# Altium schematic sheet Connectors.SchDoc
size 209 x 148 mm
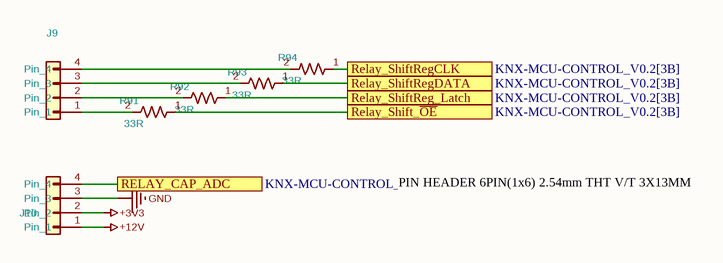
[diagram p0: Connectors.SchDoc]

## Parts
J9  DK501-1X6SBT-3X13MM  [PinHeader_1x04_P2.54mm_Vertical]  (value not drawn)
J10  DK501-1X6SBT-3X13MM  [PinHeader_1x04_P2.54mm_Vertical]  (value not drawn)
R91  33R  [R_0603_1608Metric]
R92  33R  [R_0603_1608Metric]
R93  33R  [R_0603_1608Metric]
R94  33R  [R_0603_1608Metric]

## Ports
RELAY_CAP_ADC (see KNX-MCU-CONTROL_V0.2[4C]), Relay_Shift_~{OE} (see KNX-MCU-CONTROL_V0.2[3B]), Relay_ShiftReg_Latch (see KNX-MCU-CONTROL_V0.2[3B]), Relay_ShiftRegCLK (see KNX-MCU-CONTROL_V0.2[3B]), Relay_ShiftRegDATA (see KNX-MCU-CONTROL_V0.2[3B])

## Nets
+3V3: J10.2(Pin_2)
+12V: J10.1(Pin_1)
GND: J10.3(Pin_3)
RELAY_CAP_ADC: J10.4(Pin_4) ; port RELAY_CAP_ADC
Relay_Shift_~{OE}: R91.1 ; port Relay_Shift_~{OE}
Relay_ShiftReg_Latch: R92.1 ; port Relay_ShiftReg_Latch
Relay_ShiftRegCLK: R94.1 ; port Relay_ShiftRegCLK
Relay_ShiftRegDATA: R93.1 ; port Relay_ShiftRegDATA
NetJ9_1: J9.1(Pin_1) R91.2
NetJ9_2: J9.2(Pin_2) R92.2
NetJ9_3: J9.3(Pin_3) R93.2
NetJ9_4: J9.4(Pin_4) R94.2

## Notes on the sheet
- PIN HEADER 6PIN(1x6) 2.54mm THT V/T 3X13MM
- 1
- 2
- 3
- 4
- A
- B
- Title:
- File: Connectors.kicad_sch
- Sheet: /
- C
- KiCad E.D.A.  kicad (5.1.4)-1
- Size: A5
- Date:
- Rev:
- Id: 1/1

## Library data of the parts
J9 J10 = Conn_01x04: PIN HEADER 6PIN(1x6) 2.54mm THT V/T 3X13MM; Manufacturer: OEM; Value: Conn_01x04; Footprint: Connector_PinHeader_2.54mm:PinHeader_1x04_P2.54mm_Vertical; Manufacturer Part Number: DK501-1X6SBT-3X13MM
R91-R94 = R_US: Manufacturer Part Number: RC0603JR-0733RL; Manufacturer: YAGEO; Package: R_0603; Value: 33R; Footprint: Resistor_SMD:R_0603_1608Metric